# Altium schematic sheet Level_Shifter.SchDoc
size A4
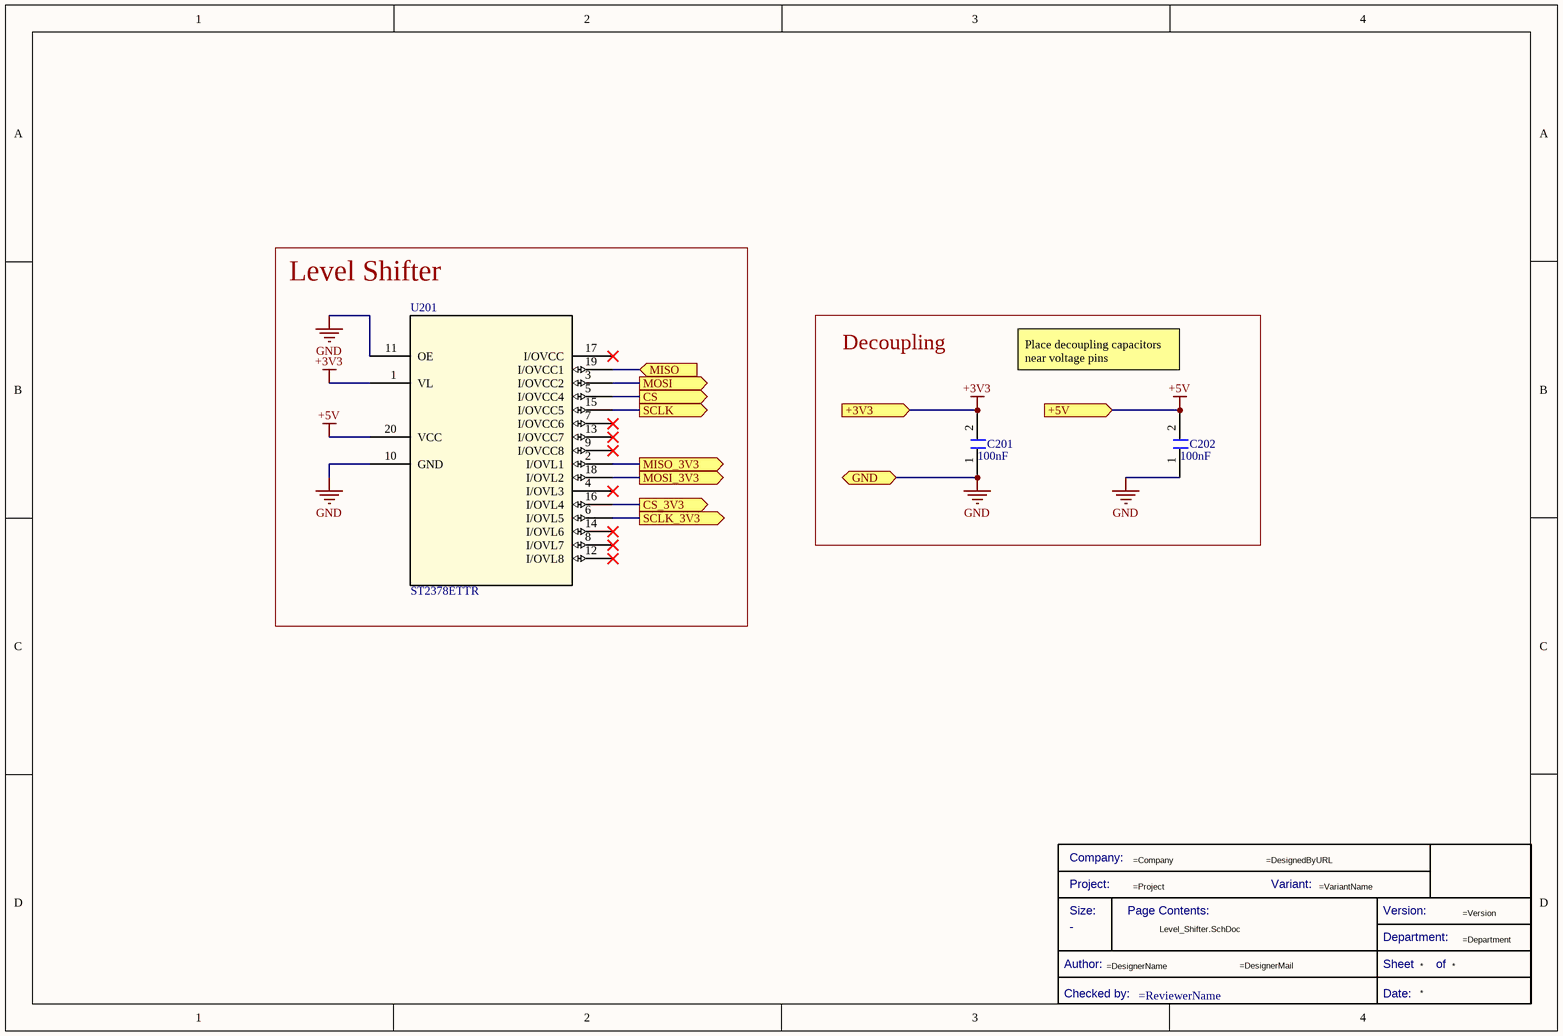
[diagram p0: Level_Shifter.SchDoc]

## Parts
*  Title Block_template  (value not drawn)  (graphical)
C201  value 100nF  [C0805FNPC-R]  (hidden comment: C100n-50V-0805FNPC-X7R)
C202  value 100nF  [C0805FNPC-R]  (hidden comment: C100n-50V-0805FNPC-X7R)
U201  ST2378ETTR  [TSSOP20_4P4X6P5_STM]

## Blocks framed on the sheet
Level Shifter: U201
Decoupling: C201 C202

## Ports
+3V3 (in), +5V (in), CS (out), CS_3V3 (out), GND (bidir), MISO (in), MISO_3V3 (out), MOSI (out), MOSI_3V3 (out), SCLK (out), SCLK_3V3 (out)

## Nets
+3V3: C201.2 U201.1(VL) ; port +3V3
+5V: C202.2 U201.20(VCC) ; port +5V
GND: C201.1 C202.1 U201.10(GND) U201.11(OE) ; port GND
CS: U201.5(I/OVCC4) ; port CS
CS_3V3: U201.16(I/OVL4) ; port CS_3V3
MISO: U201.19(I/OVCC1) ; port MISO
MISO_3V3: U201.2(I/OVL1) ; port MISO_3V3
MOSI: U201.3(I/OVCC2) ; port MOSI
MOSI_3V3: U201.18(I/OVL2) ; port MOSI_3V3
SCLK: U201.15(I/OVCC5) ; port SCLK
SCLK_3V3: U201.6(I/OVL5) ; port SCLK_3V3

Not connected (* = marked no-connect by the designer): U201 4(I/OVL3)* 7(I/OVCC6)* 8(I/OVL7)* 9(I/OVCC8)* 12(I/OVL8)* 13(I/OVCC7)* 14(I/OVL6)* 17(I/OVCC)*

## Notes on the sheet
- Place decoupling capacitors near voltage pins
- (in symbol Title Block_template) Company:; Project:; Variant:; Size:; Page Contents:; Version:; Department:; Author:; Sheet; of; Checked by:; Date:

## Library data of the parts
* = Title Block_template: Standard Title Block; .Creator: GP; Category: Title Block; .PCBcheck: GP; .SCHcheck: GP; Checked by:: =ReviewerName; Size: -
C201 C202 = CMP-00063-1: Cap, 0.1ΜF, 50V, 10%, X7R, 0805; Manufacturer 1: Wurth Electronics; Manufacturer Part Number 1: 885012207098; .Creator: DR; Pricing 1: 100=0,10200, 500=0,07100, 2000=0,06100 (GBP); ComponentLink1URL: http://www.farnell.com/datasheets/1958498.pdf?src-supplier=Farnell; Design Item ID: C100n-50V-0805FNPC-X7R; Voltage Rating (DC): 50V; Voltage Rating: 50V; Max Operating Temperature: 125°C; RoHS: Yes; Case Code (Metric): 2012; Mount: Surface Mount; REACH SVHC: Unknown; Stock 1: 8000; Source: Passives.SchLib; Tolerance: 10%; RoHS Compliant: Yes; Dielectric: X7R; ComponentLink2Description: http://www.farnell.com/datasheets/1958498.pdf?src-supplier=Element14; ComponentLink2URL: http://www.farnell.com/datasheets/1958498.pdf?src-supplier=Element14; Min Operating Temperature: -55°C; Width: 0.049inch; Category: Ceramic Capacitors; Thickness: 0.035inch; Length: 0.079inch; ComponentLink3URL: https://katalog.we-online.de/pbs/datasheet/885012207098.pdf?src-supplier=Digi-Key; Case/Package: 0805; ComponentLink3Description: https://katalog.we-online.de/pbs/datasheet/885012207098.pdf?src-supplier=Digi-Key; Packaging: Cut Tape; ComponentLink1Description: http://www.farnell.com/datasheets/1958498.pdf?src-supplier=Farnell; ComponentLink4Description: http://www.farnell.com/datasheets/1958498.pdf?src-supplier=Newark; ComponentLink4URL: http://www.farnell.com/datasheets/1958498.pdf?src-supplier=Newark
U201 = CMP-00203-1: No Description Available; Mfr_Name: STMicroelectronics; RefDes: RefDes; Source: ST2378ETTR.SchLib; Type: Type; Design Item ID: ST2378ETTR